# Altium project Anemometer.PrjPcb
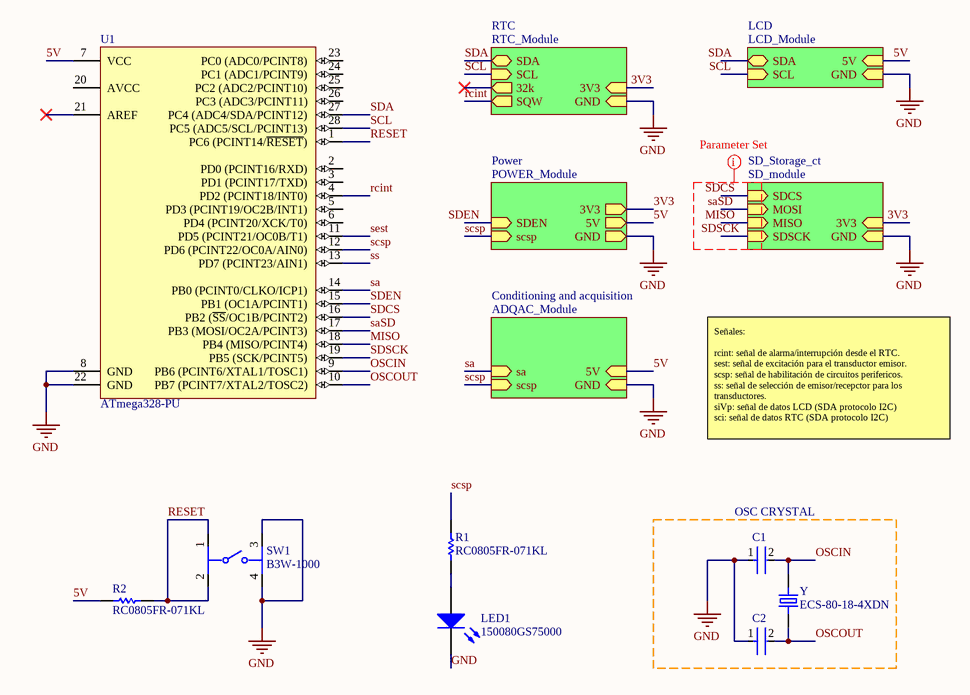
[diagram p0: Processing.SchDoc]
6 sheets, 27 parts. Net scope: hierarchical (ports join the sheet entries above them; power ports are global).
Board file: Anemometer.PcbDoc
Sheets:
  Processing.SchDoc
    SD_Storage_ct = SD_Module.SchDoc
    RTC = RTC_Module.SchDoc
    LCD = LCD_Module.SchDoc
    Power = POWER_Module.SchDoc
    Conditioning and acquisition = ADQAC_Module.SchDoc

## Sheet Processing.SchDoc
size A; SheetNumber: 1; SheetTotal: 6

### Parts
C1  C0603C200J5GACTU  [FP-C0603C-CF-MFG]  (value not drawn)
C2  C0603C200J5GACTU  [FP-C0603C-CF-MFG]  (value not drawn)
LED1  150080GS75000  [0805_A]
R1  RC0805FR-071KL  [RESC2013X60X35ML10T20]
R2  RC0805FR-071KL  [RESC2013X60X35ML10T20]
SW1  B3W-1000  [FP-B3W-1000-MFG]
U1  ATmega328-PU  [28P3]
Y  ECS-80-18-4XDN  [XTAL_ECS-80-18-4XDN]

### Blocks framed on the sheet
OSC CRYSTAL: C1 C2 Y

### Sub-sheets
Conditioning and acquisition = ADQAC_Module: GND (in), 5V (in), scsp (in), sa (in)
LCD = LCD_Module: SDA (bidir), SCL (in), 5V (in), GND (in)
Power = POWER_Module: GND (out), scsp (in), 5V (out), 3V3 (out), SDEN (in)
RTC = RTC_Module: 3V3 (in), GND (in), SDA (bidir), SCL (in), 32k (out), SQW (out)
SD_Storage_ct = SD_module: 3V3 (in), GND (in), SDCS (in), MOSI (in), MISO (in), SDSCK (in)

### Nets
GND: C1.1 C2.1 LED1.1(K) SW1.3 SW1.4 U1.8(GND) U1.22(GND) ; sheet SD_Storage_ct/GND, sheet RTC/GND, sheet LCD/GND, sheet Power/GND, sheet Conditioning and acquisition/GND
3V3: sheet SD_Storage_ct/3V3, sheet RTC/3V3, sheet Power/3V3
5V: R2.1 U1.7(VCC) ; sheet LCD/5V, sheet Power/5V, sheet Conditioning and acquisition/5V
MISO: U1.18(PB4_(MISO/PCINT4)) ; sheet SD_Storage_ct/MISO
OSCIN: C1.2 U1.9(PB6_(PCINT6/XTAL1/TOSC1)) Y.2
OSCOUT: C2.2 U1.10(PB7_(PCINT7/XTAL2/TOSC2)) Y.1
rcint: U1.4(PD2_(PCINT18/INT0)) ; sheet RTC/SQW
RESET: R2.2 SW1.1 SW1.2 U1.1(PC6_(PCINT14/~{RESET}))
sa: U1.14(PB0_(PCINT0/CLKO/ICP1)) ; sheet Conditioning and acquisition/sa
saSD: U1.17(PB3_(MOSI/OC2A/PCINT3)) ; sheet SD_Storage_ct/MOSI  [project net MOSI]
SCL: U1.28(PC5_(ADC5/SCL/PCINT13)) ; sheet RTC/SCL, sheet LCD/SCL
scsp: R1.1 U1.12(PD6_(PCINT22/OC0A/AIN0)) ; sheet Power/scsp, sheet Conditioning and acquisition/scsp
SDA: U1.27(PC4_(ADC4/SDA/PCINT12)) ; sheet RTC/SDA, sheet LCD/SDA
SDCS: U1.16(PB2_(~{SS}/OC1B/PCINT2)) ; sheet SD_Storage_ct/SDCS
SDEN: U1.15(PB1_(OC1A/PCINT1)) ; sheet Power/SDEN
SDSCK: U1.19(PB5_(SCK/PCINT5)) ; sheet SD_Storage_ct/SDSCK
sest: U1.11(PD5_(PCINT21/OC0B/T1))
ss: U1.13(PD7_(PCINT23/AIN1))
NetLED1_2: LED1.2(A) R1.2

Not connected (* = marked no-connect by the designer): U1 2(PD0_(PCINT16/RXD)) 3(PD1_(PCINT17/TXD)) 5(PD3_(PCINT19/OC2B/INT1)) 6(PD4_(PCINT20/XCK/T0)) 20(AVCC) 21(AREF)* 23(PC0_(ADC0/PCINT8)) 24(PC1_(ADC1/PCINT9)) 25(PC2_(ADC2/PCINT10)) 26(PC3_(ADC3/PCINT11))

### Layout directives
net class SPI_BUS: MISO, saSD, SDCS, SDSCK

### Notes on the sheet
- Señales:
  rcint: señal de alarma/interrupción desde el RTC.
  sest: señal de excitación para el transductor emisor.
  scsp: señal de habilitación de circuitos perifericos.
  ss: señal de selección de emisor/recepctor para los transductores.
  siVp: señal de datos LCD (SDA protocolo I2C)
  sci: señal de datos RTC (SDA protocolo I2C)

### Library data of the parts
C1 C2 = CMP-1035-00783-3: CAP CER 20PF 50V 5% NP0 0603; Manufacturer: KEMET; Temperature Coefficient: 30ppm/°C; Temperature Characteristic: C0G; Automotive Grade: Grade 1; Tolerance: 0.05; Material: Ceramic; Category: Cap; Manufacturer Part Number: C0603C200J5GACTU; Temperature Range Low: -55°C; RoHS: TRUE; ComponentLink2URL: https://api.kemet.com/component-edge/download/datasheet/C0603C100J5GACAUTO.pdf; Package: C0603C-CF; Height: 0.87mm; Capacitance: 20 pF; Voltage Rating: 50 V; Octopart: https://octopart.com/c0603c200j5gactu-kemet-9138585; Device Class L1: Passive Components; Automotive: Yes; Digikey Description: CAP CER 20PF 50V 5% NP0 0603; Temperature Range High: +125°C; Device Class L3: Ceramic Capacitors; Mouser Description: Multilayer Ceramic Capacitors MLCC - SMD/SMT 50volts 20pF C0G 5%; ComponentLink2Description: Datasheet; Device Class L2: Capacitors; Lead Free: Yes; Temperature: -55°C to +125°C; Value: 20 pF
LED1 = CMP-1426-00007-1: SMD mono-color Chip LED, WL-SMCW, Green; Manufacturer: Wuerth Elektronik; PackageReference: 0805_A; Color: Green; PartNumber: 150080GS75000; ComponentLink2URL: http://katalog.we-online.com/led/datasheet/150080GS75000.pdf; ComponentLink1URL: http://www.we-online.com; ComponentLink1Description: Manufacturer URL; ComponentLink2Description: Datasheet
R1 R2 = CMP-2100-03671-1: Chip Resistor, 1 KOhm, +/- 1%, 125 mW, -55 to 155 degC, 0805 (2012 Metric), RoHS, Tape and Reel; Manufacturer: Yageo; Temperature Coefficient: 100ppm/degreesC; Voltage Rating (DC): 150V; Max Power Dissipation: 125mW; Resistance: 1KOhm; Number of Pins: 2; Number of Terminations: 2; Datasheet URL: http://www.yageo.com/NewPortal/yageodocoutput?fileName=/pdf/R-Chip/PYu-RC_Group_51_RoHS_L_5.pdf; Length: 0.079inch; Package Description: 2-Pin Surface Mounted Device, Body 2 x 1.25 mm; Depth: 1.25mm; Height: 0.024inch; Military Standard: Not; Case/Package: 0805; Package Reference: 0805; RoHSCompliant: true; Lead Free: LeadFree; Packaging: TapeandReel; Package Quantity: 1; Datasheet Version: Rev. 5, 10/2016; Tolerance: 1%; Min Operating Temperature: -55degC; Voltage Rating: 150V; Composition: ThickFilm; Case Code (Imperial): 0805; Power Rating: 125mW; Width: 0.049inch; Case Code (Metric): 2012; Manufacturer URL: http://www.yageo.com/; Max Operating Temperature: 155degC; REACH SVHC: Unknown; Termination: SMD/SMT
SW1 = CMP-08834-000045-1: SWITCH TACTILE SPST-NO 0.05A 24V; Actuator Color: White; Actuator Type: Standard; Current Rating: 50mA; Ratings: IP67; Number of Poles: 1; Illumination Type: Non-Illuminated; Actuator Length: 0.9mm; Switch Function: Off-Mom; Mechanical Life: 1000000Cycles; Throw Configuration: SPST; Operating Force: 1.57N; Contact Resistance: 100mR; Switch Travel: 0.25mm; Mount: Through Hole; Orientation: Straight; Termination: PC Pins; Series: B3W; Max Operating Temperature: 70°C; Contact Plating: Silver; Max Current Rating: 50mA; RoHS Compliant: Yes; Packaging: Bulk; Contact Material: Silver; Length: 6.6mm; Voltage Rating (DC): 24V; Min Operating Temperature: -25°C; Radiation Hardening: No; Package Quantity: 100; Depth: 6.6mm; Max Voltage Rating (DC): 24V; Weight: 0.3g; Insulation Resistance: 100MR; Contact Current Rating: 50mA
U1 = CMP-0095-00015-2: 8-bit AVR Microcontroller, 32KB Flash, 1KB EEPROM, 2KB SRAM, 28-pin PDIP, Industrial Grade (-40°C to 85°C); ComponentLink3Description: ATmega48A/48PA/88A/88PA/168A/168PA/328/328P Summary; RevisionNote: DatasheetVersion updated. URLs added.; DatasheetVersion: revD, May-2011; ComponentLink1URL: http://www.atmel.com/; PackageVersion: revB, Sep-2001; PackageDescription: 28-lead (0.300"/7.62mm Wide) Plastic Dual Inline Package (PDIP); PackageReference: 28P3; ComponentLink1Description: Manufacturer URL; ComponentLink2Description: ATmega48A/48PA/88A/88PA/168A/168PA/328/328P Datasheet; ComponentLink3URL: http://www.atmel.com/dyn/resources/prod_documents/8271S.pdf; ComponentLink2URL: http://www.atmel.com/dyn/resources/prod_documents/8271.pdf
Y = ECS-80-18-4XDN: 8MHz Â±30ppm Crystal 18pF 80 Ohms HC-49/US; MF: ECS Inc.; Digi-Key_Part_Number: X1115-ND; Package: HC-49/US ECS International; Value: *; SnapEDA_Link: https://www.snapeda.com/parts/ECS-80-18-4XDN/ECS%20Inc./view-part/49558/?ref=snap; Digi-Key_Purchase_URL: https://www.digikey.in/product-detail/en/ecs-inc/ECS-80-18-4XDN/X1115-ND/827606?utm_source=snapeda&utm_medium=aggregator&utm_campaign=symbol; MP: ECS-80-18-4XDN

## Sheet SD_Module.SchDoc
size A; SheetNumber: 3; SheetTotal: 6
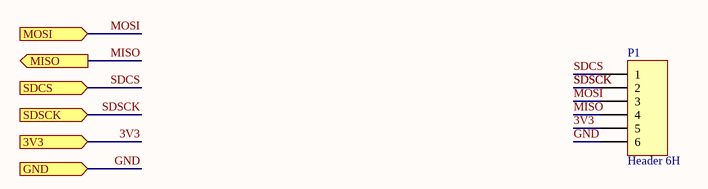
[diagram p1: SD_Module.SchDoc]

### Parts
P1  Header 6H  [HDR1X6H]

### Ports
3V3 (in), GND (in), MISO (out), MOSI (in), SDCS (in), SDSCK (in)

### Nets
GND: P1.6 ; port GND
3V3: P1.5 ; port 3V3
MISO: P1.4 ; port MISO
MOSI: P1.3 ; port MOSI
SDCS: P1.1 ; port SDCS
SDSCK: P1.2 ; port SDSCK

### Library data of the parts
P1 = Header 6H: Header, 6-Pin, Right Angle; LatestRevisionDate: 17-Jul-2002; LatestRevisionNote: Re-released for DXP Platform.; Publisher: Altium Limited

## Sheet RTC_Module.SchDoc
size A; SheetNumber: 5; SheetTotal: 6
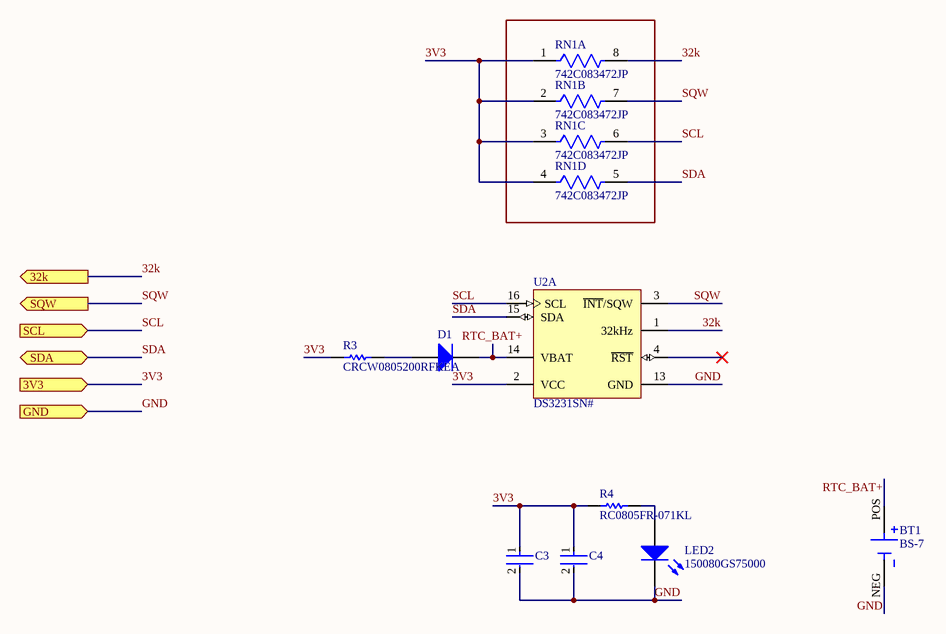
[diagram p2: RTC_Module.SchDoc]

### Parts
BT1  BS-7  [BAT_BS-7]
C3  C0805C104K5RACTU  [FP-C0805C-DN-MFG]  (value not drawn)
C4  C0805C104K5RACTU  [FP-C0805C-DN-MFG]  (value not drawn)
D1  1N4148W-7-F  [DIOD-SOD123-2_V]  (value not drawn)
LED2  150080GS75000  [0805_A]
R3  CRCW0805200RFKEA  [RESC2013X50X30NL20T20]
R4  RC0805FR-071KL  [RESC2013X60X35ML10T20]
RN1  742C083472JP  [FP-742C083-MFG]  (parts A,B,C,D of 4)
U2  DS3231SN#  [W16#H2_M]  (part A of 2)

### Ports
3V3 (in), 32k (out), GND (in), SCL (in), SDA (bidir), SQW (out)

### Nets
GND: BT1.NEG C3.2 C4.2 LED2.1(K) U2.13(GND) ; port GND
3V3: C3.1 C4.1 R3.2 R4.2 RN1.1 RN1.2 RN1.3 RN1.4 U2.2(VCC) ; port 3V3
32k: RN1.8 U2.1(32kHz) ; port 32k
RTC_BAT+: BT1.POS D1.2(K) U2.14(VBAT)
SCL: RN1.6 U2.16(SCL) ; port SCL
SDA: RN1.5 U2.15(SDA) ; port SDA
SQW: RN1.7 U2.3(~{INT}/SQW) ; port SQW  [project net rcint]
NetD1_1: D1.1(A) R3.1
NetLED2_2: LED2.2(A) R4.1

Not connected (* = marked no-connect by the designer): U2 4(~{RST})*

### Library data of the parts
BT1 = BS-7: BATTERY HOLDER COIN 20MM PC PIN; MF: MPD _Memory; Value: *; SnapEDA_Link: https://www.snapeda.com/parts/BS-7/MPD%20%28Memory%20Protection%20Devices%29/view-part/4219629/?ref=snap; MP: BS-7; Availability: Unavailable; Price: None; Package: None
C3 C4 = CMP-2007-00279-2: CAP CER 0.1UF 50V X7R 0805; Manufacturer: KEMET; Value: 0.10 μF; Tolerance: 0.1; Temperature Coefficient: 30ppm/°C; Material: Ceramic; Manufacturer Part Number: C0805C104K5RACTU; Device Class L2: Capacitors; Temperature Range Low: -55°C; Voltage Rating: 50 V; Digikey Description: CAP CER 0.1UF 50V X7R 0805; Category: Cap; ComponentLink2Description: Datasheet; Octopart: https://octopart.com/c0805c104k5ractu-kemet-143926; RoHS: TRUE; ComponentLink2URL: https://content.kemet.com/datasheets/KEM_C1003_C0G_SMD.pdf; Temperature Characteristic: X7R; Temperature: -55°C to +125°C; Height: 0.88mm; Temperature Range High: +125°C; Device Class L1: Passive Components; Automotive: No; Lead Free: Yes; Ipc Land Pattern Name: CAPC200125X78; Device Class L3: Ceramic Capacitors; Mouser Description: Cap Ceramic 0.1uF 50V X7R 10% SMD 2.0 x 1.2 mm 125 C Paper T/R; Capacitance: 0.10 μF; Package: C0805C-DN
D1 = CMP-2000-04932-2: Fast Switching Diode, 100 V, 0.15 A, -65 to 150 degC, 2-Pin?SOD123, RoHS, Tape and Reel; Recovery Time: 4ns; Brand: DiodesIncorporated; Unit Weight: 0.000353oz; Max Surge Current: 2A; Peak Reverse Voltage: 100V; Ir - Reverse Current: 1uA; Vf - Forward Voltage: 1.25V; Configuration: Single; If - Forward Current: 0.15A; Product Category: Diodes-GeneralPurpose,Power,Switching; Operating Temperature Range: -65Cto+150C; Packaging: Reel; Manufacturer URL: http://www.diodes.com/; Maximum Operating Temperature: +150C; Height: 1.25mm; Minimum Operating Temperature: -65C; Product: SwitchingDiodes; Package URL: http://www.diodes.com/datasheets/ds18004.pdf; Type: SwitchingDiode; Package Reference: SOD123-2; Width: 1.7mm; Datasheet URL: http://www.farnell.com/datasheets/1915529.pdf; Datasheet Version: Rev. 24-2, 10/2013; Series: 1N4148; Factory Pack Quantity: 3000; Length: 2.85mm; RoHS: True; Manufacturer: DiodesIncorporated; Mounting Style: SMD/SMT; Package / Case: SOD-123
LED2 = CMP-1426-00007-1: as LED1 on sheet Processing; PackageReference: 0805_A; Color: Green; PartNumber: 150080GS75000; ComponentLink2URL: http://katalog.we-online.com/led/datasheet/150080GS75000.pdf; ComponentLink1URL: http://www.we-online.com; ComponentLink1Description: Manufacturer URL; ComponentLink2Description: Datasheet
R3 = CMP-2001-03663-1: Manufacturer: Vishay Dale; Part Number: CRCW0805200RFKEA
R4 = CMP-2100-03671-1: as R1 on sheet Processing; Number of Pins: 2; Number of Terminations: 2; Datasheet URL: http://www.yageo.com/NewPortal/yageodocoutput?fileName=/pdf/R-Chip/PYu-RC_Group_51_RoHS_L_5.pdf; Length: 0.079inch; Package Description: 2-Pin Surface Mounted Device, Body 2 x 1.25 mm; Depth: 1.25mm; Height: 0.024inch; Military Standard: Not; Case/Package: 0805; Package Reference: 0805; RoHSCompliant: true; Lead Free: LeadFree; Packaging: TapeandReel; Package Quantity: 1; Datasheet Version: Rev. 5, 10/2016; Tolerance: 1%; Min Operating Temperature: -55degC; Voltage Rating: 150V; Composition: ThickFilm; Case Code (Imperial): 0805; Power Rating: 125mW; Width: 0.049inch; Case Code (Metric): 2012; Manufacturer URL: http://www.yageo.com/; Max Operating Temperature: 155degC; REACH SVHC: Unknown; Termination: SMD/SMT
RN1 = CMP-06828-000002-1: RES ARRAY 4 RES 4.7K OHM 1206; Tolerance: 5%; Resistance: 4.7kR; Power Per Element: 62.5mW; Number of Resistors: 4; Power Rating: 250mW; Power Dissipation: 63mW; Working Voltage: 50V; Circuit Type: Isolated; Temperature Coefficient: 200ppm/°C; Depth: 1.6mm; Max Operating Temperature: 125°C; Contact Plating: Tin; Width: 0.063inch; Packaging: Tape and Reel; Termination: Concave; Length: 3.2mm; Case Code (Imperial): 1206; Case Code (Metric): 3216; Case/Package: Molded; Military Standard: Not; Mount: Surface Mount; Number of Elements: 4; Package Quantity: 1; Min Operating Temperature: -55°C; Number of Pins: 8; Radiation Hardening: No; Terminal Pitch: 0.8mm; Height: 0.028inch; Number of Terminals: 8; Lead Free: Lead Free
U2 = CMP-0254-00293-2: Extremely Accurate I2C-Integrated Real-Time Clock/TCXO/Crystal, 16-Pin SO, -40 to 85 degC, RoHS Qualified; Code_IPC: SOIC127P1030-16; ComponentLink2URL: http://datasheets.maxim-ic.com/en/ds/DS3231.pdf; Code_JEDEC: MS-013-AA; ComponentLink1URL: http://www.maxim-ic.com; ComponentLink2Description: Datasheet; ComponentLink3Description: Package Specification; DatasheetVersion: Rev 8, Jul-2010; PackageVersion: revD, 2010; ComponentLink1Description: Manufacturer URL; PackageDescription: 16-Pin Small-Outline IC, Wide (0.3in), 1.27 mm Pitch, SOIC (W), RoHS Qualified; ComponentLink3URL: http://pdfserv.maxim-ic.com/package_dwgs/21-0042.PDF; PackageReference: W16#H2

## Sheet LCD_Module.SchDoc
size A; SheetNumber: 6; SheetTotal: 6
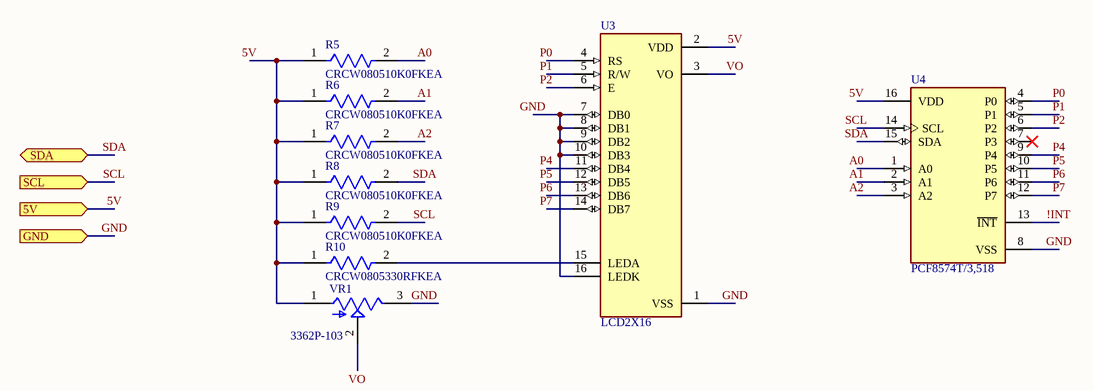
[diagram p3: LCD_Module.SchDoc]

### Parts
R5  CRCW080510K0FKEA  [FP-CRCW0805-e3-IPC_A]
R6  CRCW080510K0FKEA  [FP-CRCW0805-e3-IPC_A]
R7  CRCW080510K0FKEA  [FP-CRCW0805-e3-IPC_A]
R8  CRCW080510K0FKEA  [FP-CRCW0805-e3-IPC_A]
R9  CRCW080510K0FKEA  [FP-CRCW0805-e3-IPC_A]
R10  CRCW0805330RFKEA  [FP-CRCW0805-e3-MFG]
U3  LCD2X16  [LCD_LCD2X16]
U4  PCF8574T/3,518  [FP-SOT162-1-MFG]
VR1  3362P-103  [TRIM_3362P-103]

### Ports
5V (in), GND (in), SCL (in), SDA (bidir)

### Nets
GND: U3.1(VSS) U3.7(DB0) U3.8(DB1) U3.9(DB2) U3.10(DB3) U3.16(LEDK) U4.8(VSS) VR1.3(CW) ; port GND
5V: R5.1 R6.1 R7.1 R8.1 R9.1 R10.1 U3.2(VDD) U4.16(VDD) VR1.1(CCW) ; port 5V
!INT: U4.13(~{INT})
A0: R5.2 U4.1(A0)
A1: R6.2 U4.2(A1)
A2: R7.2 U4.3(A2)
P0: U3.4(RS) U4.4(P0)
P1: U3.5(R/W) U4.5(P1)
P2: U3.6(E) U4.6(P2)
P4: U3.11(DB4) U4.9(P4)
P5: U3.12(DB5) U4.10(P5)
P6: U3.13(DB6) U4.11(P6)
P7: U3.14(DB7) U4.12(P7)
SCL: R9.2 U4.14(SCL) ; port SCL
SDA: R8.2 U4.15(SDA) ; port SDA
VO: U3.3(VO) VR1.2(WIPER)
NetR10_2: R10.2 U3.15(LEDA)

Not connected (* = marked no-connect by the designer): U4 7(P3)*

### Library data of the parts
R5-R9 = CMP-2001-04908-2: RES Thick Film, 10kΩ, 1%, 0.125W, 100ppm/°C, 0805; Resistance: 10kR; Voltage Rating (DC): 150V; Power Rating: 125mW; Weight: 0.000194oz; Package Quantity: 5000; Military Standard: Not; Max Operating Temperature: 155°C; Temperature Coefficient: 100ppm/°C; Contact Plating: Tin; Width: 1.25mm; Height: 0.45mm; Radiation Hardening: No; Tolerance: 1%; Min Operating Temperature: -55°C; Voltage Rating: 150V; Length: 2mm; Depth: 1.25mm; Termination: SMD/SMT; Packaging: Tape and Reel; Case/Package: 0805; Case Code (Metric): 2012; Lead Free: Lead Free; Case Code (Imperial): 0805; Composition: Thick Film
R10 = CMP-2001-03823-2: RES Thick Film, 330Ω, 1%, 0.125W, 100ppm/°C, 0805; Voltage Rating (DC): 150V; Resistance: 330R; Max Power Dissipation: 125mW; Mount: Surface Mount; Packaging: Tape and Reel; Min Operating Temperature: -55°C; Military Standard: Not; Case Code (Metric): 2012; Height: 0.02inch; Voltage Rating: 150V; Case/Package: 0805; Max Operating Temperature: 155°C; Width: 0.049inch; Case Code (Imperial): 0805; Termination: SMD/SMT; Lead Free: Lead Free; Contact Plating: Tin; Package Quantity: 10; Composition: Thick Film; Length: 2mm; Features: Automotive AEC-Q200; Depth: 1.25mm; Weight: 0.000194oz; Tolerance: 1%; Power Rating: 125mW; Number of Terminations: 2; Temperature Coefficient: 100ppm/°C
U3 = LCD2X16: Display; Display: LCD 2x16 characters (blue backlight); MF: mikroElektronika; SnapEDA_Link: https://www.snapeda.com/parts/LCD2X16/mikroElektronika/view-part/2472530/?ref=snap; Price: None; Package: None; Availability: Unavailable; Value: *; MP: LCD2X16
U4 = CMP-10112-000010-1: IC I/O EXPANDER I2C 8B 16SOIC; Manufacturer: NXP Semiconductors; Frequency: 100kHz; Max Supply Voltage: 6V; Standoff Height: 0.1mm; Nominal Supply Current: 40uA; Max Junction Temp: +125°C; Min Supply Voltage: 2.5V; Number Of I/Os: 8; Manufacturer Part Number: PCF8574T/3,518; Footprint Url: https://www.nxp.com/docs/en/package-information/SOT162-1.pdf; ComponentLink2URL: https://www.nxp.com/docs/en/data-sheet/PCF8574_PCF8574A.pdf; Automotive: No; Digikey Description: IC I/O EXPANDER I2C 8B 16SOIC; Mouser Description: PCF8574 Series 2.5 - 6V Remote 8-bit I/O Expander for I2C-bus - SOIC-16; Ipc Land Pattern Name: SOIC127P1032X265-16; Interface: I2C; Octopart: https://octopart.com/pcf8574t%2F3%2C518-nxp+semiconductors-10470852; Ambient Temperature Range Low: -40°C; Lead Free: Yes; Device Class L2: Interface ICs; Temperature Range High: +85°C; Device Class L1: Integrated Circuits (ICs); Package: SOT162-1; ComponentLink2Description: Datasheet; Device Class L3: I/O Expanders; Temperature: -40°C to +85°C; Ambient Temperature Range High: +85°C; Height: 2.65mm; Category: IC; RoHS: TRUE; Temperature Range Low: -40°C
VR1 = 3362P-103: Res Cermet Trimmer 50K Ohm 10% 1/2W 1(Elec)/1(Mech)Turn 2.77mm (6.6 X 6.99 X 4.7mm) Pin Thru-Hole Tube; Package: None; Price: None; Value: *; MP: 3362P-103; Availability: Unavailable

## Sheet POWER_Module.SchDoc
size A; SheetNumber: 2; SheetTotal: 6
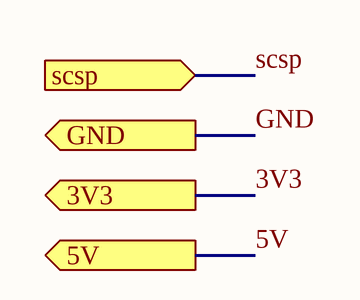
[diagram p4: POWER_Module.SchDoc]

### Ports
3V3 (out), 5V (out), GND (out), scsp (in)

## Sheet ADQAC_Module.SchDoc
size A; SheetNumber: 4; SheetTotal: 6

## Nets that join several sheets
GND: Processing (7 pins), SD_Module (P1.6), RTC_Module (5 pins), LCD_Module (8 pins)
3V3: SD_Module (P1.5), RTC_Module (9 pins)
5V: Processing (R2.1 U1.7), LCD_Module (9 pins)
MISO: Processing (U1.18), SD_Module (P1.4)
MOSI: Processing (U1.17), SD_Module (P1.3)
rcint: Processing (U1.4), RTC_Module (RN1.7 U2.3)
SCL: Processing (U1.28), RTC_Module (RN1.6 U2.16), LCD_Module (R9.2 U4.14)
SDA: Processing (U1.27), RTC_Module (RN1.5 U2.15), LCD_Module (R8.2 U4.15)
SDCS: Processing (U1.16), SD_Module (P1.1)
SDSCK: Processing (U1.19), SD_Module (P1.2)